# Altium project ESP32_Watch.PrjPcb
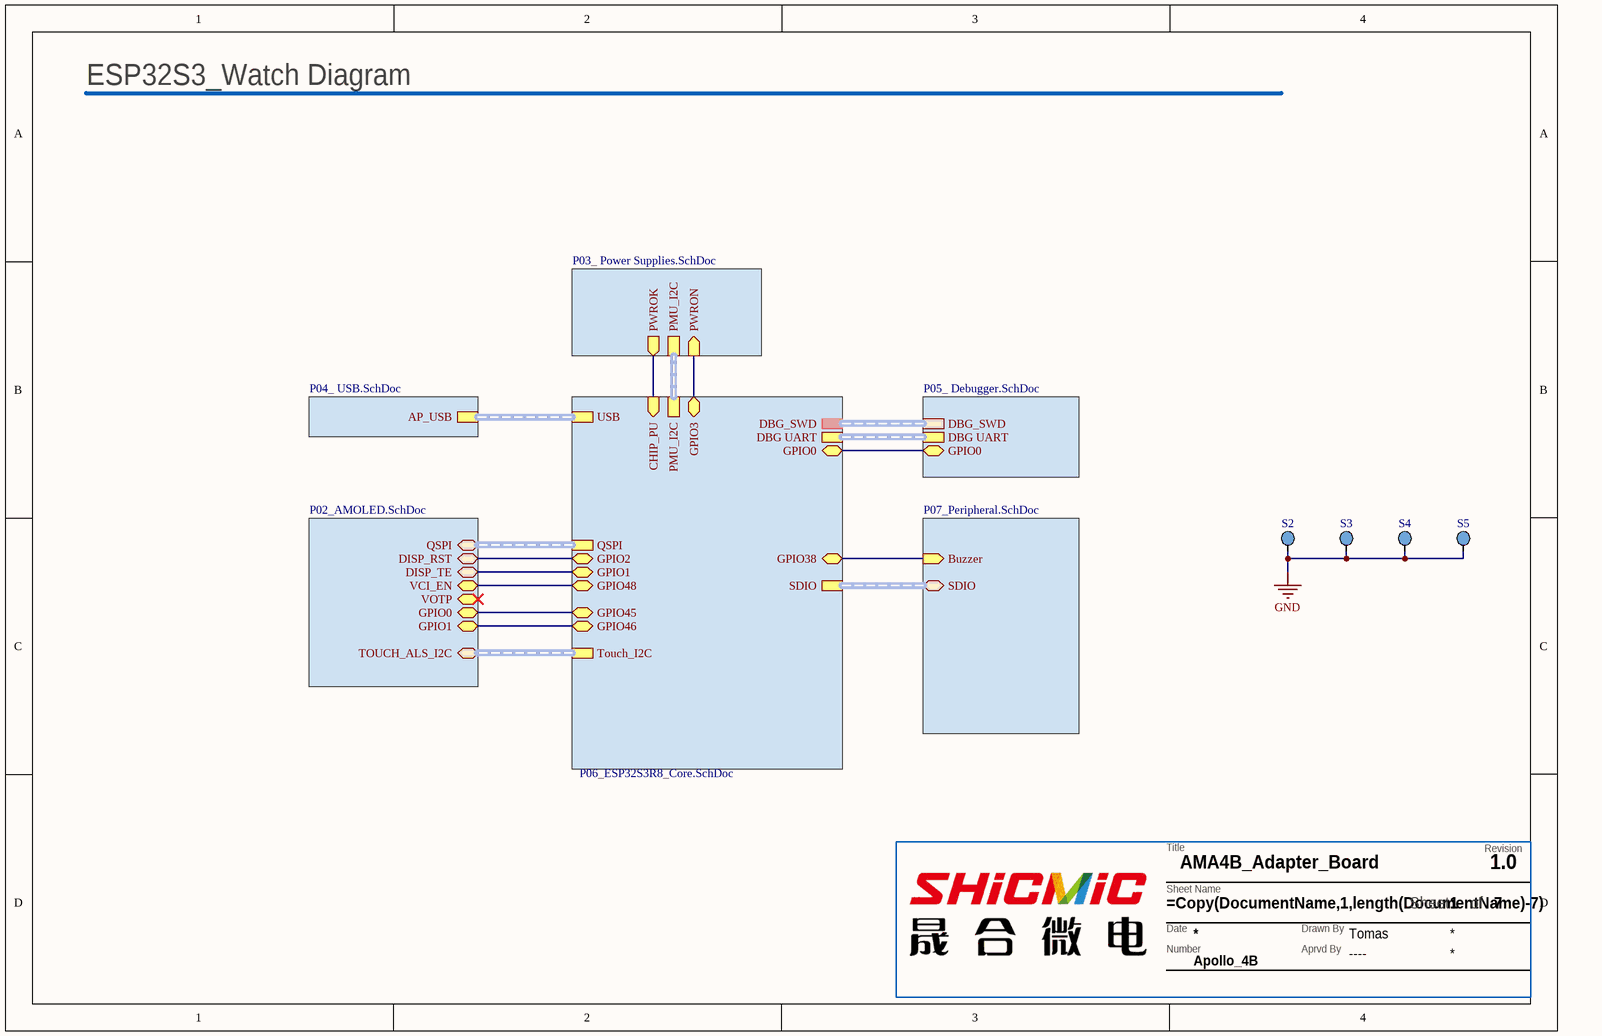
[diagram p0: P01_Top Level.SchDoc]
SheetTotal: 7; TBApprovedBy: ----; TBBoardNumber: Apollo_4B; TBDocumentNumber: Apollo_4B; TBDrawnBy: Tomas; TBRevision: 1.0; TBTitle: AMA4B_Adapter_Board
7 sheets, 75 parts. Net scope: hierarchical (ports join the sheet entries above them; power ports are global).
Board file: ESP_Watch_PCB.PcbDoc
Sheets:
  P01_Top Level.SchDoc
    U_P06_ Apollo4B_core = P06_ESP32S3R8_Core.SchDoc
    U_P03_ Power Supplies = P03_ Power Supplies.SchDoc
    U_P04_ USB = P04_ USB.SchDoc
    U_P05_ Debugger = P05_ Debugger.SchDoc
    U_P02_ AMOLED = P02_AMOLED.SchDoc
    P07_Peripheral = P07_Peripheral.SchDoc

## Sheet P01_Top Level.SchDoc
size A4; SheetNumber: 1; SheetTotal: 7

### Parts
(Parts that share a designator on the sheet are numbered #1, #2 ... from top to bottom, then left to right.)
?#1  TitleBlock  (value not drawn)  (graphical)
S2  Screw_2.9  [HOLE-3.2MM_M]  (value not drawn)
S3  Screw_2.9  [HOLE-3.2MM_M]  (value not drawn)
S4  Screw_2.9  [HOLE-3.2MM_M]  (value not drawn)
S5  Screw_2.9  [HOLE-3.2MM_M]  (value not drawn)

### Sub-sheets
P07_Peripheral = P07_Peripheral.SchDoc: SDIO (bidir, harness SDIO), Buzzer (in)
U_P02_ AMOLED = P02_AMOLED.SchDoc: QSPI (bidir, harness QSPI), DISP_TE (bidir), TOUCH_ALS_I2C (bidir, harness TOUCH_ALS_I2C), DISP_RST (bidir), VOTP (bidir), VCI_EN (bidir), GPIO0 (bidir), GPIO1 (bidir)
U_P03_ Power Supplies = P03_ Power Supplies.SchDoc: PWROK (out), PMU_I2C (harness PMU_I2C), PWRON (in)
U_P04_ USB = P04_ USB.SchDoc: AP_USB (harness USB)
U_P05_ Debugger = P05_ Debugger.SchDoc: DBG_SWD (harness SWD), DBG UART (harness UART), GPIO0 (bidir)
U_P06_ Apollo4B_core = P06_ESP32S3R8_Core.SchDoc: QSPI (harness QSPI), SDIO (harness SDIO), USB (harness USB), DBG_SWD (harness SWD), Touch_I2C (harness TOUCH_ALS_I2C), DBG UART (harness UART), PMU_I2C (harness PMU_I2C), GPIO0 (bidir), GPIO38 (bidir), GPIO1 (bidir), CHIP_PU (in), GPIO48 (bidir), GPIO2 (bidir), GPIO3 (bidir), GPIO45 (bidir), GPIO46 (bidir)

### Nets
GND: S2.1 S3.1 S4.1 S5.1
CHIP_PU: sheet U_P06_ Apollo4B_core/CHIP_PU, sheet U_P03_ Power Supplies/PWROK
GPIO0: sheet U_P06_ Apollo4B_core/GPIO0, sheet U_P05_ Debugger/GPIO0
GPIO1: sheet U_P06_ Apollo4B_core/GPIO1, sheet U_P02_ AMOLED/DISP_TE
GPIO2: sheet U_P06_ Apollo4B_core/GPIO2, sheet U_P02_ AMOLED/DISP_RST
GPIO3: sheet U_P06_ Apollo4B_core/GPIO3, sheet U_P03_ Power Supplies/PWRON
GPIO38: sheet U_P06_ Apollo4B_core/GPIO38, sheet P07_Peripheral/Buzzer
GPIO45: sheet U_P06_ Apollo4B_core/GPIO45, sheet U_P02_ AMOLED/GPIO0
GPIO46: sheet U_P06_ Apollo4B_core/GPIO46, sheet U_P02_ AMOLED/GPIO1
GPIO48: sheet U_P06_ Apollo4B_core/GPIO48, sheet U_P02_ AMOLED/VCI_EN

### Buses and harness runs
harness sheet P07_Peripheral/SDIO = sheet U_P06_ Apollo4B_core/SDIO
harness sheet U_P02_ AMOLED/QSPI = sheet U_P06_ Apollo4B_core/QSPI
harness sheet U_P02_ AMOLED/TOUCH_ALS_I2C = sheet U_P06_ Apollo4B_core/Touch_I2C
harness sheet U_P03_ Power Supplies/PMU_I2C = sheet U_P06_ Apollo4B_core/PMU_I2C
harness sheet U_P04_ USB/AP_USB = sheet U_P06_ Apollo4B_core/USB
harness sheet U_P05_ Debugger/DBG UART = sheet U_P06_ Apollo4B_core/DBG UART
harness sheet U_P05_ Debugger/DBG_SWD = sheet U_P06_ Apollo4B_core/DBG_SWD

### Notes on the sheet
- ESP32S3_Watch Diagram
- (in symbol TitleBlock) Revision; Title; Sheet Name; Sheet; of; Date; Drawn By; Number; Aprvd By

### Library data of the parts
?#1 = TitleBlock: Title block for Ambiq Schematics. Please have the following parameters entered in Project>Project Options>Parameters: / TBTitle / TBDocumentNumber / TBRevision / TBDrawnBy / TBApprovedBy; AMBIQ PN: TitleBlock

## Sheet P06_ESP32S3R8_Core.SchDoc
size A4; SheetNumber: 6; SheetTotal: 7
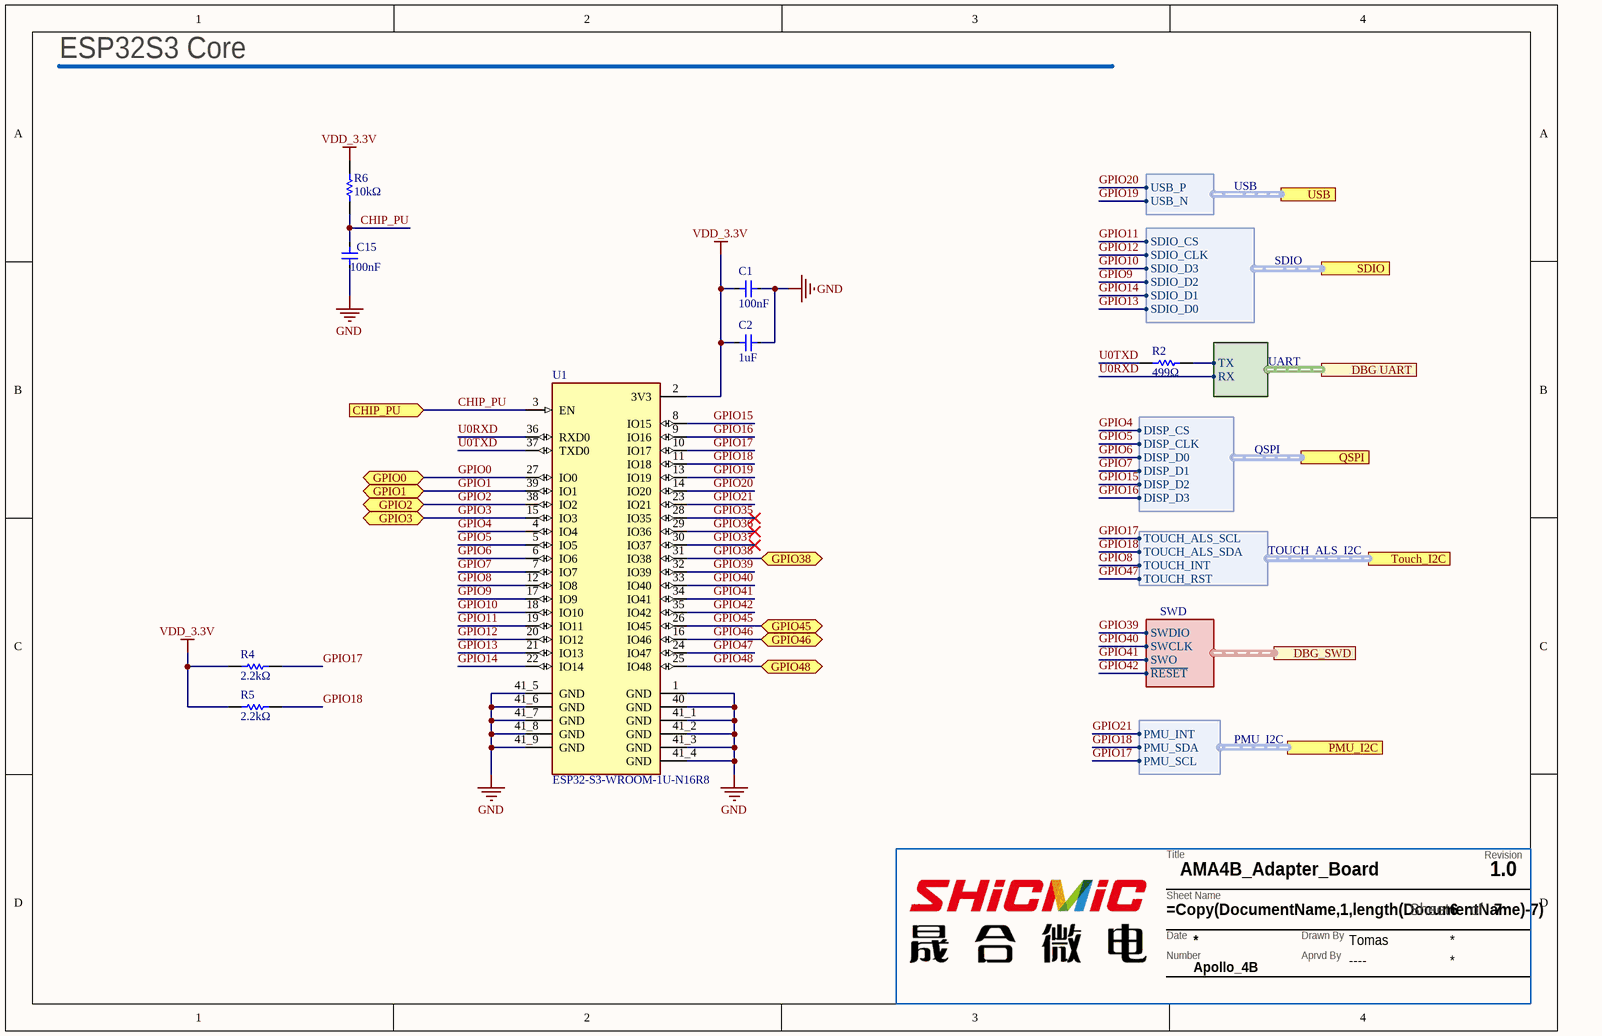
[diagram p1: P06_ESP32S3R8_Core.SchDoc]

### Parts
(Parts that share a designator on the sheet are numbered #1, #2 ... from top to bottom, then left to right.)
?#2  TitleBlock  (value not drawn)  (graphical)
C1  100nF  [CAP_0402]
C2  1uF  [CAP_0402]
C15  100nF  [CAP_0402]
R2  499Ω  [RES_0402]
R4  2.2kΩ  [RES_0402]
R5  2.2kΩ  [RES_0402]
R6  10kΩ  [RES_0402]
U1  ESP32-S3-WROOM-1U-N16R8  [XCVR_ESP32-S3-WROOM-1U-N16R8]

### Ports
CHIP_PU (in), DBG UART (harness UART), DBG_SWD (harness SWD), GPIO0 (bidir), GPIO1 (bidir), GPIO2 (bidir), GPIO3 (bidir), GPIO38 (bidir), GPIO45 (bidir), GPIO46 (bidir), GPIO48 (bidir), PMU_I2C (harness PMU_I2C), QSPI (harness QSPI), SDIO (harness SDIO), Touch_I2C (harness TOUCH_ALS_I2C), USB (harness USB)

### Harnesses
QSPI: DISP_CLK, DISP_CS, DISP_D0, DISP_D1, DISP_D2, DISP_D3
TOUCH_ALS_I2C: TOUCH_ALS_SCL, TOUCH_ALS_SDA, TOUCH_INT, TOUCH_RST
SDIO: SDIO_CLK, SDIO_CS, SDIO_D0, SDIO_D1, SDIO_D2, SDIO_D3
USB: USB_N, USB_P
SWD: SWCLK, SWDIO, SWO, ~{RESET}
UART: TX, RX
PMU_I2C: PMU_SCL, PMU_SDA, PMU_INT

### Nets
GND: C1.2 C2.2 C15.2 U1.1(GND) U1.40(GND) U1.41_1(GND) U1.41_2(GND) U1.41_3(GND) U1.41_4(GND) U1.41_5(GND) U1.41_6(GND) U1.41_7(GND) U1.41_8(GND) U1.41_9(GND)
VDD_3.3V: C1.1 C2.1 R4.1 R5.1 R6.2 U1.2(3V3)
CHIP_PU: C15.1 R6.1 U1.3(EN) ; port CHIP_PU
GPIO0: U1.27(IO0) ; port GPIO0
GPIO1: U1.39(IO1) ; port GPIO1
GPIO2: U1.38(IO2) ; port GPIO2
GPIO3: U1.15(IO3) ; port GPIO3
GPIO4: U1.4(IO4) ; port QSPI.DISP_CS
GPIO5: U1.5(IO5) ; port QSPI.DISP_CLK
GPIO6: U1.6(IO6) ; port QSPI.DISP_D0
GPIO7: U1.7(IO7) ; port QSPI.DISP_D1
GPIO8: U1.12(IO8) ; port Touch_I2C.TOUCH_INT
GPIO9: U1.17(IO9) ; port SDIO.SDIO_D2
GPIO10: U1.18(IO10) ; port SDIO.SDIO_D3
GPIO11: U1.19(IO11) ; port SDIO.SDIO_CS
GPIO12: U1.20(IO12) ; port SDIO.SDIO_CLK
GPIO13: U1.21(IO13) ; port SDIO.SDIO_D0
GPIO14: U1.22(IO14) ; port SDIO.SDIO_D1
GPIO15: U1.8(IO15) ; port QSPI.DISP_D2
GPIO16: U1.9(IO16) ; port QSPI.DISP_D3
GPIO17: R4.2 U1.10(IO17) ; port Touch_I2C.TOUCH_ALS_SCL, port PMU_I2C.PMU_SCL
GPIO18: R5.2 U1.11(IO18) ; port Touch_I2C.TOUCH_ALS_SDA, port PMU_I2C.PMU_SDA
GPIO19: U1.13(IO19) ; port USB.USB_N  [project net AP_USB_N]
GPIO20: U1.14(IO20) ; port USB.USB_P  [project net AP_USB_P]
GPIO21: U1.23(IO21) ; port PMU_I2C.PMU_INT
GPIO35: U1.28(IO35)
GPIO36: U1.29(IO36)
GPIO37: U1.30(IO37)
GPIO38: U1.31(IO38) ; port GPIO38
GPIO39: U1.32(IO39) ; port DBG_SWD.SWDIO
GPIO40: U1.33(IO40) ; port DBG_SWD.SWCLK
GPIO41: U1.34(IO41) ; port DBG_SWD.SWO
GPIO42: U1.35(IO42) ; port DBG_SWD.~{RESET}
GPIO45: U1.26(IO45) ; port GPIO45
GPIO46: U1.16(IO46) ; port GPIO46
GPIO47: U1.24(IO47) ; port Touch_I2C.TOUCH_RST
GPIO48: U1.25(IO48) ; port GPIO48
U0RXD: U1.36(RXD0) ; port DBG UART.RX
U0TXD: R2.1 U1.37(TXD0)
NetR2_2: R2.2 ; port DBG UART.TX

### Notes on the sheet
- ESP32S3 Core
- (in symbol TitleBlock) Revision; Title; Sheet Name; Sheet; of; Date; Drawn By; Number; Aprvd By

### Library data of the parts
?#2 = TitleBlock: as ?#1 on sheet P01_Top Level; AMBIQ PN: TitleBlock
C1 C15 = Capacitor: NONE; Manufacturer: Samsung; Manufacturer Part Number: CL05A105MP5NNNC; AMBIQ PN: CL05A105KP5NNNC; Capacitance: 1uF; Tolerance: 20%; Voltage Rating: 10V; Dielectric: X5R; Supplier 1: Newark; Supplier Part Number 1: 82AC9184; RoHS: Yes; Category: Ceramic Capacitors; Mount: Surface Mount; Case/Package: 0402; Case Code (Metric): 1005; Case Code (Imperial): 0402; Min Operating Temperature: -55°C; Max Operating Temperature: 85°C; Packaging: Tape and Reel; Voltage Rating (DC): 10V; Series: CL; Construction: Flat; Length: 1mm; Width: 0.02inch; Height: 0.5mm; Thickness: 0.022inch; Depth: 0.5mm; Radiation Hardening: No; Lead Free: Lead Free; RoHS Compliant: Yes; ComponentLink1URL: https://datasheet.ciiva.com/25802/cl05a105mp5nnnc-25802049.pdf?src-supplier=Digi-Key; ComponentLink1Description: https://datasheet.ciiva.com/25802/cl05a105mp5nnnc-25802049.pdf?src-supplier=Digi-Key; Package Quantity: 1
C2 = Capacitor: NONE; Manufacturer: Samsung; Manufacturer Part Number: CL05A105MP5NNNC; AMBIQ PN: CL05A105KP5NNNC; Tolerance: 20%; Voltage Rating: 10V; Dielectric: X5R; Supplier 1: Newark; Supplier Part Number 1: 82AC9184; RoHS: Yes; Category: Ceramic Capacitors; Mount: Surface Mount; Case/Package: 0402; Case Code (Metric): 1005; Case Code (Imperial): 0402; Min Operating Temperature: -55°C; Max Operating Temperature: 85°C; Capacitance: 1uF; Packaging: Tape and Reel; Voltage Rating (DC): 10V; Series: CL; Construction: Flat; Length: 1mm; Width: 0.02inch; Height: 0.5mm; Thickness: 0.022inch; Depth: 0.5mm; Radiation Hardening: No; Lead Free: Lead Free; RoHS Compliant: Yes; ComponentLink1URL: https://datasheet.ciiva.com/25802/cl05a105mp5nnnc-25802049.pdf?src-supplier=Digi-Key; ComponentLink1Description: https://datasheet.ciiva.com/25802/cl05a105mp5nnnc-25802049.pdf?src-supplier=Digi-Key; Package Quantity: 1
R2 R4-R6 = Resistor: Res Thick Film 0402 20K Ohm 1% 1/16W ±100ppm/°C Molded SMD Paper T/R; Manufacturer: Vishay; AMBIQ PN: CRCW040220K0FKED; Resistance: 20kR; Power Rating: 63mW; Voltage Rating: 50V; Supplier 1: Newark; Supplier Part Number 1: 24W2083; Manufacturer Part Number: CRCW040220K0FKED; RoHS: Yes; Category: Chip SMD Resistors; Stock 1: 380000; Pricing 1: 1=0.00600, 10000=0.00600 (USD); Mount: Surface Mount; Case/Package: 0402; Weight: 2.3E-05oz; Case Code (Metric): 1005; Case Code (Imperial): 0402; Contact Plating: Tin; Min Operating Temperature: -55°C; Max Operating Temperature: 155°C; Package Quantity: 10; Packaging: Tape and Reel; Resistor Type: Thick Film; Number of Terminations: 2; Termination: SMD/SMT; Max Power Dissipation: 63mW; Temperature Coefficient: 100ppm/°C; Voltage Rating (DC): 50V; Features: Automotive AEC-Q200; Series: CRCW; Technology: THICK FILM; Construction: Rectangular; Length: 1mm; Width: 0.5mm; Height: 0.35mm; Depth: 0.5mm; Radiation Hardening: No; REACH SVHC: Unknown; Military Standard: Not; Lead Free: Lead Free; RoHS Compliant: Yes; ComponentLink1URL: https://datasheet.ciiva.com/11810/0900766b80d98824-11810023.pdf?src-supplier=RSComponents; ComponentLink1Description: https://datasheet.ciiva.com/11810/0900766b80d98824-11810023.pdf?src-supplier=RSComponents; ComponentLink2URL: https://datasheet.ciiva.com/2463/dcrcwe3-2463139.pdf?src-supplier=Digi-Key; ComponentLink2Description: https://datasheet.ciiva.com/2463/dcrcwe3-2463139.pdf?src-supplier=Digi-Key; ComponentLink3URL: https://datasheet.ciiva.com/2463/dcrcwe3-2463140.pdf?src-supplier=Digi-Key; Tolerance: 1%; Number of Pins: 2; Resistance Tolerance: 1%; Working Voltage: 50V
U1 = ESP32-S3-WROOM-1U-N16R8: Bluetooth, WiFi 802.11b/g/n, Bluetooth v5.0 Transceiver Module 2.4GHz Antenna Not Included, U.FL Surface Mount; MF: Espressif Systems; Package: None; Price: None; Value: *; SnapEDA_Link: https://www.snapeda.com/parts/ESP32-S3-WROOM-1U-N16R8/Espressif+Systems/view-part/?ref=snap; MP: ESP32-S3-WROOM-1U-N16R8; Availability: Unavailable; Check_prices: https://www.snapeda.com/parts/ESP32-S3-WROOM-1U-N16R8/Espressif+Systems/view-part/?ref=eda

## Sheet P03_ Power Supplies.SchDoc
size A3; SheetNumber: 3; SheetTotal: 7
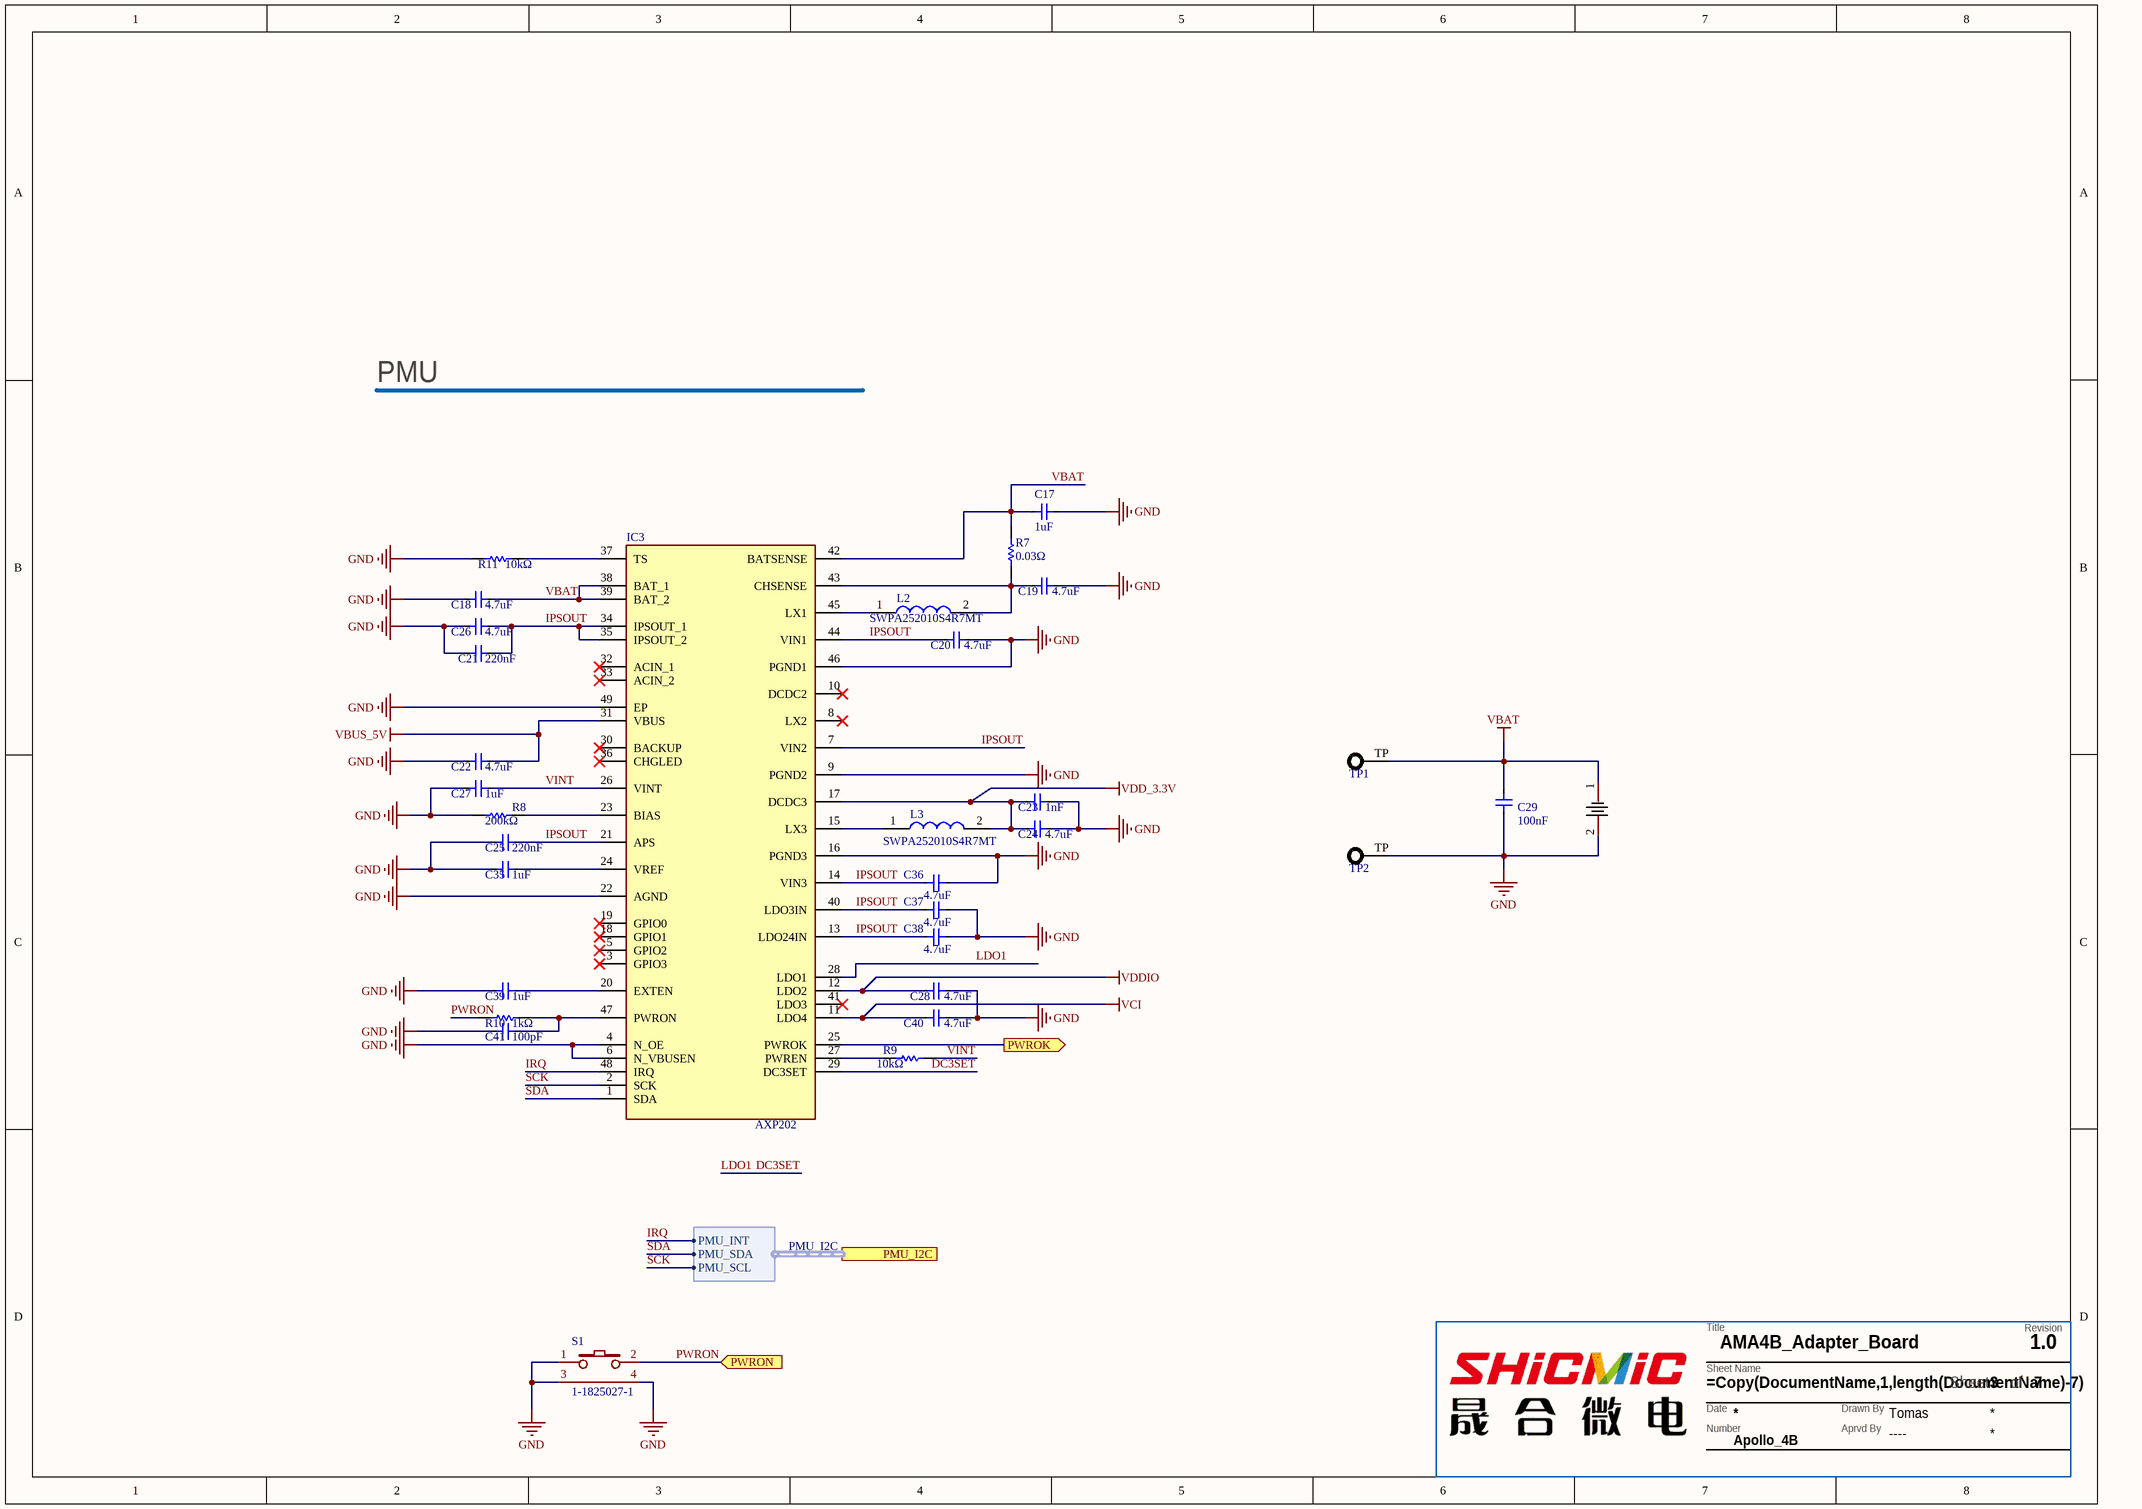
[diagram p2: P03_ Power Supplies.SchDoc]

### Parts
(Parts that share a designator on the sheet are numbered #1, #2 ... from top to bottom, then left to right.)
?#3  TitleBlock  (value not drawn)  (graphical)
BT1  BH-18650-B1BA002  [BATTERY-SMD_18650-1S-L77.1-W20.7-1]  (value not drawn)
C17  1uF  [CAP_0402]
C18  4.7uF  [CAP_0402]
C19  4.7uF  [CAP_0402]
C20  4.7uF  [CAP_0402]
C21  220nF  [CAP_0402]
C22  4.7uF  [CAP_0402]
C23  1nF  [CAP_0402]
C24  4.7uF  [CAP_0402]
C25  220nF  [CAP_0402]
C26  4.7uF  [CAP_0402]
C27  1uF  [CAP_0402]
C28  4.7uF  [CAP_0402]
C29  100nF  [CAP_0402]
C35  1uF  [CAP_0402]
C36  4.7uF  [CAP_0402]
C37  4.7uF  [CAP_0402]
C38  4.7uF  [CAP_0402]
C39  1uF  [CAP_0402]
C40  4.7uF  [CAP_0402]
C41  100pF  [CAP_0402]
IC3  AXP202  [QFN40P600X600X80-49N-D]
L2  SWPA252010S4R7MT  [SWPA252010S4R7MT]
L3  SWPA252010S4R7MT  [SWPA252010S4R7MT]
R7  0.03Ω  [RESC2013X58N]
R8  200kΩ  [RES_0402]
R9  10kΩ  [RES_0402]
R10  1kΩ  [RES_0402]
R11  10kΩ  [RES_0402]
S1  1-1825027-1  [1825027-5]
TP1  PAD  [TPPAD_1.0mm]  (value not drawn)  (no BOM)
TP2  PAD  [TPPAD_1.0mm]  (value not drawn)  (no BOM)

### Ports
PMU_I2C (harness PMU_I2C), PWROK (out), PWRON (in)

### Harnesses
PMU_I2C: PMU_SCL, PMU_SDA, PMU_INT

### Nets
GND: BT1.2 C17.1 C18.1 C19.1 C20.1 C21.1 C22.1 C23.1 C24.1 C25.1 C26.1 C27.1 C28.1 C29.2 C35.1 C36.1 C37.1 C38.1 C39.1 C40.1 C41.1 IC3.4(N_OE) IC3.6(N_VBUSEN) IC3.9(PGND2) IC3.16(PGND3) IC3.22(AGND) IC3.46(PGND1) IC3.49(EP) R8.1 R11.1 S1.1 S1.3(MH1) S1.4(MH2) TP2.TP
VBAT: BT1.1 C17.2 C18.2 C29.1 IC3.38(BAT_1) IC3.39(BAT_2) IC3.42(BATSENSE) R7.2 TP1.TP
VBUS_5V: C22.2 IC3.31(VBUS)
VCI: C40.2 IC3.11(LDO4)
VDD_3.3V: C23.2 C24.2 IC3.17(DCDC3) L3.2
VDDIO: C28.2 IC3.12(LDO2)
CHIP_PU: IC3.25(PWROK) ; port PWROK
DC3SET: IC3.28(LDO1) IC3.29(DC3SET)  [also labelled LDO1]
IPSOUT: C20.2 C21.2 C25.2 C26.2 C36.2 C37.2 C38.2 IC3.7(VIN2) IC3.13(LDO24IN) IC3.14(VIN3) IC3.21(APS) IC3.34(IPSOUT_1) IC3.35(IPSOUT_2) IC3.40(LDO3IN) IC3.44(VIN1)
IRQ: IC3.48(IRQ) ; port PMU_I2C.PMU_INT  [project net GPIO21]
PWRON: R10.1 S1.2 ; port PWRON  [project net GPIO3]
SCK: IC3.2(SCK) ; port PMU_I2C.PMU_SCL  [project net GPIO17]
SDA: IC3.1(SDA) ; port PMU_I2C.PMU_SDA  [project net GPIO18]
VINT: C27.2 IC3.26(VINT) R9.1
NetC19_2: C19.2 IC3.43(CHSENSE) L2.2 R7.1
NetC35_2: C35.2 IC3.24(VREF)
NetC39_2: C39.2 IC3.20(EXTEN)
NetC41_2: C41.2 IC3.47(PWRON) R10.2
NetIC3_15: IC3.15(LX3) L3.1
NetIC3_23: IC3.23(BIAS) R8.2
NetIC3_27: IC3.27(PWREN) R9.2
NetIC3_37: IC3.37(TS) R11.2
NetIC3_45: IC3.45(LX1) L2.1

Not connected (* = marked no-connect by the designer): IC3 3(GPIO3)* 5(GPIO2)* 8(LX2)* 10(DCDC2)* 18(GPIO1)* 19(GPIO0)* 30(BACKUP)* 32(ACIN_1)* 33(ACIN_2)* 36(CHGLED)* 41(LDO3)*

### Notes on the sheet
- PMU
- (in symbol TitleBlock) Revision; Title; Sheet Name; Sheet; of; Date; Drawn By; Number; Aprvd By

### Library data of the parts
?#3 = TitleBlock: as ?#1 on sheet P01_Top Level; AMBIQ PN: TitleBlock
BT1 = BH-18650-B1BA002: Manufacturer: MYOUNG(美阳); Add into BOM: yes; Connector Type: 电池盒; Battery Type: 18650; Name: BH-18650-B1BA002; Symbol: BH-18650-B1BA002; Device: BH-18650-B1BA002; LCSC Part Name: 电池盒 适用电池:18650; Supplier Part: C2988620; Manufacturer Part: BH-18650-B1BA002; Supplier Footprint: SMD; JLCPCB Part Class: Extended Part; Datasheet: https://atta.szlcsc.com/upload/public/pdf/source/20220402/870DB99AB50CA0DF8D51CF7C86A51FAB.pdf; Supplier: LCSC; Convert to PCB: yes
C17-C28 C35-C41 = Capacitor: NONE; Manufacturer: Samsung; AMBIQ PN: CL05A225KP5NNNC; Capacitance: 2.2uF; Tolerance: 10%; Voltage Rating: 10V; Supplier 1: Arrow Electronics; Supplier Part Number 1: CL05A225KP5NNNC; Manufacturer Part Number: CL05A225KP5NNNC; RoHS: Yes; Category: Ceramic Capacitors; Stock 1: 32414; Pricing 1: 1=0.14620, 10=0.09980, 25=0.09880, 100=0.05200, 250=0.05150, 500=0.03630, 1000=0.02990, 3000=0.02760, 6000=0.02610, 15000=0.023; Mount: Surface Mount; Case/Package: 0402; Case Code (Metric): 1005; Case Code (Imperial): 0402; Min Operating Temperature: -55°C; Max Operating Temperature: 85°C; Packaging: Tape and Reel; Voltage Rating (DC): 10V; Series: CL; Length: 0.039inch; Width: 0.02inch; Thickness: 0.022inch; RoHS Compliant: Yes; ComponentLink1URL: https://datasheet.ciiva.com/25727/cl05a225kp5nnnc-25727777.pdf?src-supplier=Digi-Key; ComponentLink1Description: https://datasheet.ciiva.com/25727/cl05a225kp5nnnc-25727777.pdf?src-supplier=Digi-Key; Package Quantity: 1
C29 = Capacitor: NONE; Manufacturer: Kyocera AVX; AMBIQ PN: 0201ZD104KAT2A; Tolerance: 10%; Voltage Rating: 10V; Supplier 1: Arrow Electronics; Supplier Part Number 1: 0201ZD104KAT2A; Manufacturer Part Number: 0201ZD104KAT2A; RoHS: Yes; Category: Ceramic Capacitors; Stock 1: 105000; Pricing 1: 15000=0.00770, 30000=0.00750, 45000=0.00740, 60000=0.00720, 75000=0.00690, 150000=0.00620 (USD); Mount: Surface Mount; Case/Package: 0201; Case Code (Metric): 0603; Case Code (Imperial): 0201; Min Operating Temperature: -55°C; Max Operating Temperature: 85°C; Capacitance: 100nF; Packaging: Tape and Reel; Voltage Rating (DC): 10V; Series: -; Lead Free: Lead Free; RoHS Compliant: Yes; ComponentLink1URL: http://www.mouser.com/ds/2/40/cx5r-776519.pdf?src-supplier=Mouser; ComponentLink1Description: http://www.mouser.com/ds/2/40/cx5r-776519.pdf?src-supplier=Mouser
IC3 = AXP202: Integrated Circuit; Manufacturer_Name: X-Powers; Datasheet Link: http://www.x-powers.com/en.php/Info/down/id/55; Height: 0.8mm; Manufacturer_Part_Number: AXP202
L2 L3 = SWPA252010S4R7MT: Inductor; Manufacturer_Name: SUNLORD; Datasheet Link: https://www.sunlordinc.com/Download.aspx?file=L1VwbG9hZEZpbGVzL1BERl9DYXQvMjAyMjA2MDcxMDAxMzg2MzEucGRm&lan=en; Height: 1mm; Manufacturer_Part_Number: SWPA252010S4R7MT
R7 = WSL0805R0300FEA18: Resistor; Manufacturer_Name: Vishay; Datasheet Link: https://www.vishay.com/docs/31057/wslhigh.pdf; Height: 0.584mm; Manufacturer_Part_Number: WSL0805R0300FEA18; Mouser Part Number: 71-WSL0805R0300FEA18; Mouser Price/Stock: https://www.mouser.co.uk/ProductDetail/Vishay-Dale/WSL0805R0300FEA18?qs=Dk6UgDv3OKgnZ05Ewij84g%3D%3D
R8-R11 = Resistor: Surface Mount Thick Film Resistor, Rc Series, 10 Kohm, 62.5 Mw, - 1%, 50 V, 0402 [1005 Metric]; Manufacturer: Yageo; AMBIQ PN: RC0402FR-0710KL; Resistance: 10kR; Power Rating: 62.5mW; Voltage Rating: 50V; Max Power Dissipation: 63mW; Temperature Coefficient: 100ppm/°C; Supplier 1: Arrow Electronics; Supplier Part Number 1: RC0402FR-0710KL; Manufacturer Part Number: RC0402FR-0710KL; RoHS: Yes; Category: Chip SMD Resistors; Stock 1: 7776428; Pricing 1: 10000=0.00210 (USD); Case/Package: 0402; Case Code (Metric): 1005; Case Code (Imperial): 0402; Min Operating Temperature: -55°C; Max Operating Temperature: 155°C; Packaging: Tape and Reel; Resistor Type: Thick Film; Number of Terminations: 2; Termination: SMD/SMT; Voltage Rating (DC): 50V; Features: Moisture Resistant; Series: RC; Construction: Rectangular; Length: 1mm; Width: 0.5mm; Height: 0.32mm; Depth: 0.5mm; REACH SVHC: No SVHC; Military Standard: Not; Lead Free: Lead Free; RoHS Compliant: Yes; ComponentLink1URL: https://datasheet.ciiva.com/7660/38568-7660787.pdf?src-supplier=Element14; ComponentLink1Description: https://datasheet.ciiva.com/7660/38568-7660787.pdf?src-supplier=Element14; ComponentLink2URL: https://datasheet.ciiva.com/7849/1686128-7849814.pdf?src-supplier=Element14; ComponentLink2Description: https://datasheet.ciiva.com/7849/1686128-7849814.pdf?src-supplier=Element14; ComponentLink3URL: https://datasheet.ciiva.com/7983/1018594-7983486.pdf?src-supplier=Element14; Tolerance: 1%; Number of Pins: 2; Resistance Tolerance: 1%; Working Voltage: 50V; Lead Pitch: 0.2mm
S1 = 1-1825027-1: Switch; Manufacturer_Name: TE Connectivity; Manufacturer_Part_Number: FSMRA4JH04; Datasheet Link: https://www.te.com/commerce/DocumentDelivery/DDEController?Action=srchrtrv&DocNm=1308111-1_SWITCHES_CORE_PROGRAM_CATALOG&DocType=CS&DocLang=English; Height: 7.01mm; Mouser Part Number: 506-FSMRA4JH04; Mouser Price/Stock: https://www.mouser.co.uk/ProductDetail/TE-Connectivity-Alcoswitch/FSMRA4JH04?qs=65SUpkGmTbapQKkEnx7SmQ%3D%3D; Arrow Part Number: 1-1825027-1; Arrow Price/Stock: https://www.arrow.com/en/products/1-1825027-1/te-connectivity
TP1 TP2 = TP_PAD: None; AMBIQ PN: TP_PAD

## Sheet P04_ USB.SchDoc
size A4; SheetNumber: 4; SheetTotal: 7
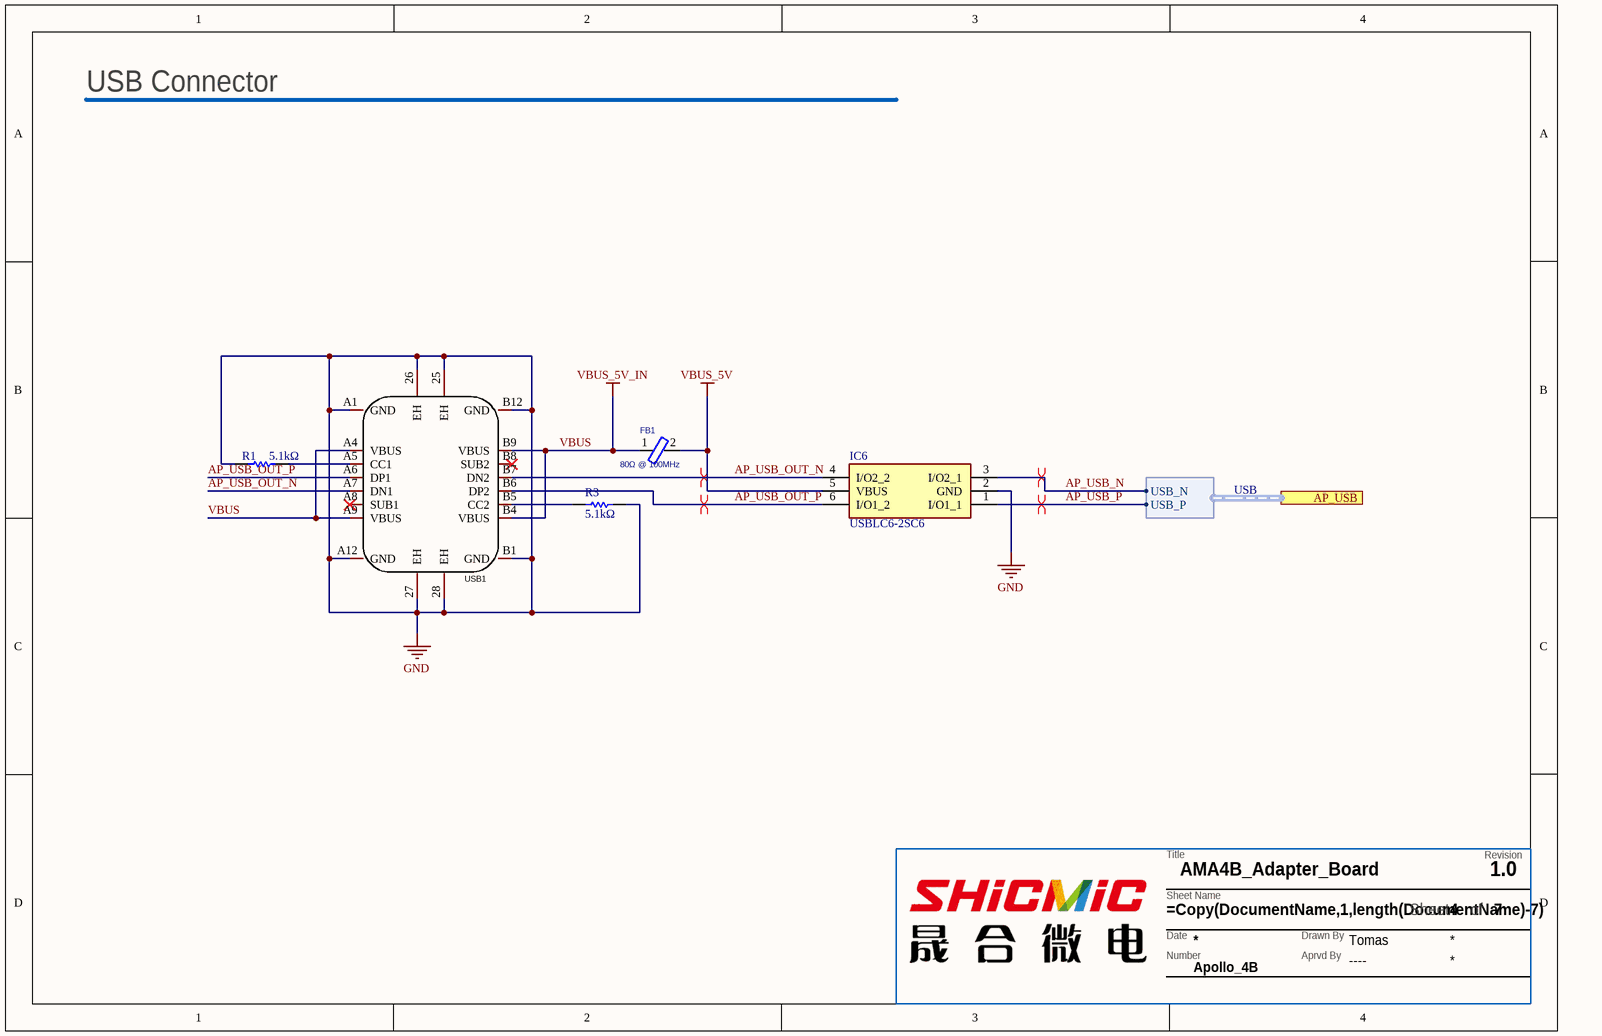
[diagram p3: P04_ USB.SchDoc]

### Parts
(Parts that share a designator on the sheet are numbered #1, #2 ... from top to bottom, then left to right.)
?#4  TitleBlock  (value not drawn)  (graphical)
FB1  80Ω @ 100MHz  [IPC_A]
IC6  USBLC6-2SC6  [SOT95P280X145-6N]
R1  5.1kΩ  [RES_0402]
R3  5.1kΩ  [RES_0402]
USB1  TYPE-C 16P CB1.6 073  [USB-C-SMD_SHOU_TYPE-C-16P-CB1.6]  (value not drawn)

### Ports
AP_USB (harness USB)

### Harnesses
USB: USB_N, USB_P

### Nets
GND: IC6.2(GND) R1.1 R3.2 USB1.25(EH) USB1.26(EH) USB1.27(EH) USB1.28(EH) USB1.A1(GND) USB1.A12(GND) USB1.B1(GND) USB1.B12(GND)
VBUS: FB1.1 USB1.A4(VBUS) USB1.A9(VBUS) USB1.B4(VBUS) USB1.B9(VBUS)  [also labelled VBUS_5V_IN]
VBUS_5V: FB1.2 IC6.5(VBUS)
AP_USB_N: IC6.3(I/O2_1) ; port AP_USB.USB_N
AP_USB_OUT_N: IC6.4(I/O2_2) USB1.A7(DN1) USB1.B7(DN2)
AP_USB_OUT_P: IC6.6(I/O1_2) USB1.A6(DP1) USB1.B6(DP2)
AP_USB_P: IC6.1(I/O1_1) ; port AP_USB.USB_P
NetR1_2: R1.2 USB1.A5(CC1)
NetR3_1: R3.1 USB1.B5(CC2)

Not connected (* = marked no-connect by the designer): USB1 A8(SUB1)* B8(SUB2)*

### Layout directives
differential pair: AP_USB_N, AP_USB_OUT_N, AP_USB_OUT_P, AP_USB_P

### Notes on the sheet
- USB Connector
- (in symbol TitleBlock) Revision; Title; Sheet Name; Sheet; of; Date; Drawn By; Number; Aprvd By

### Library data of the parts
?#4 = TitleBlock: as ?#1 on sheet P01_Top Level; AMBIQ PN: TitleBlock
FB1 = Ferrite: NONE; Manufacturer: Taiyo Yuden; AMBIQ PN: FBMJ3216HS800-T; Impedance: 80R; Tolerance: 25%; DC Resistance (DCR): 10mR; Max DC Current: 4A; Number of Lines: 1; Shielding: Unshielded; Supplier 1: Newark; Supplier Part Number 1: 86H5353; Manufacturer Part Number: FBMJ3216HS800-T; RoHS: Yes; Category: Ferrite Beads and Chips; Stock 1: 265; Pricing 1: 1=0.30000, 10=0.20700, 25=0.17700, 50=0.14800, 100=0.11800 (USD); ComponentLink1URL: https://datasheet.ciiva.com/5709/chipbeads01-e-5709344.pdf?src-supplier=Farnell; ComponentLink1Description: https://datasheet.ciiva.com/5709/chipbeads01-e-5709344.pdf?src-supplier=Farnell; Mount: Surface Mount; Case/Package: 1206; Number of Pins: 2; Core Material: Ferrite; Case Code (Metric): 3216; Case Code (Imperial): 1206; Material: Ferrite; Min Operating Temperature: -40°C; Max Operating Temperature: 125°C; Packaging: Tape and Reel; Resistance: 10mR; Package Quantity: 1; Max Current Rating: 4A; Termination: SMD/SMT; Test Frequency: 100MHz; Frequency: 100MHz; Series: FB; Resistor Type: Ferrite Bead; Length: 3.2mm; Width: 0.063inch; Height: 1.3mm; Depth: 1.8mm; Lead Free: Lead Free; Halogen Free: Halogen Free; REACH SVHC: No SVHC; ComponentLink2URL: https://datasheet.ciiva.com/16001/202fbmj3216hs800-t-16001070.pdf?src-supplier=Onlinecomponents.com; ComponentLink2Description: https://datasheet.ciiva.com/16001/202fbmj3216hs800-t-16001070.pdf?src-supplier=Onlinecomponents.com; ComponentLink3URL: https://datasheet.ciiva.com/30088/23fbmj3216hs800-t-30088710.pdf?src-supplier=Onlinecomponents.com; ComponentLink3Description: https://datasheet.ciiva.com/30088/23fbmj3216hs800-t-30088710.pdf?src-supplier=Onlinecomponents.com; ComponentLink4URL: https://datasheet.ciiva.com/23606/fbmj3216hs800-t-ss-23606768.pdf?src-supplier=Newark; ComponentLink4Description: https://datasheet.ciiva.com/23606/fbmj3216hs800-t-ss-23606768.pdf?src-supplier=Newark; ComponentLink5URL: https://datasheet.ciiva.com/25614/0900766b810b37be-25614395.pdf?src-supplier=RSComponents; ComponentLink5Description: https://datasheet.ciiva.com/25614/0900766b810b37be-25614395.pdf?src-supplier=RSComponents; ComponentLink6URL: https://datasheet.ciiva.com/6212/chipbeads01-e-6212909.pdf?src-supplier=Digi-Key; ComponentLink6Description: https://datasheet.ciiva.com/6212/chipbeads01-e-6212909.pdf?src-supplier=Digi-Key; ComponentLink7URL: https://datasheet.ciiva.com/7966/chipbeads01-e-7966171.pdf?src-supplier=Element14; ComponentLink7Description: https://datasheet.ciiva.com/7966/chipbeads01-e-7966171.pdf?src-supplier=Element14
IC6 = USBLC6-2SC6: Integrated Circuit; Manufacturer_Name: STMicroelectronics; Datasheet Link: http://www.st.com/st-web-ui/static/active/en/resource/technical/document/datasheet/CD00050750.pdf; Height: 1.45mm; Manufacturer_Part_Number: USBLC6-2SC6; Mouser Part Number: 511-USBLC6-2SC6; Mouser Price/Stock: https://www.mouser.co.uk/ProductDetail/STMicroelectronics/USBLC6-2SC6?qs=po45yt2pPpu%2FhNIlwQdTlg%3D%3D; Arrow Part Number: USBLC6-2SC6; Arrow Price/Stock: https://www.arrow.com/en/products/usblc6-2sc6/stmicroelectronics?region=nac
R1 R3 = Resistor: as R2 on sheet P06_ESP32S3R8_Core; Supplier 1: Newark; Supplier Part Number 1: 24W2083; Manufacturer Part Number: CRCW040220K0FKED; RoHS: Yes; Category: Chip SMD Resistors; Stock 1: 380000; Pricing 1: 1=0.00600, 10000=0.00600 (USD); Mount: Surface Mount; Case/Package: 0402; Weight: 2.3E-05oz; Case Code (Metric): 1005; Case Code (Imperial): 0402; Contact Plating: Tin; Min Operating Temperature: -55°C; Max Operating Temperature: 155°C; Package Quantity: 10; Packaging: Tape and Reel; Resistor Type: Thick Film; Number of Terminations: 2; Termination: SMD/SMT; Max Power Dissipation: 63mW; Temperature Coefficient: 100ppm/°C; Voltage Rating (DC): 50V; Features: Automotive AEC-Q200; Series: CRCW; Technology: THICK FILM; Construction: Rectangular; Length: 1mm; Width: 0.5mm; Height: 0.35mm; Depth: 0.5mm; Radiation Hardening: No; REACH SVHC: Unknown; Military Standard: Not; Lead Free: Lead Free; RoHS Compliant: Yes; ComponentLink1URL: https://datasheet.ciiva.com/11810/0900766b80d98824-11810023.pdf?src-supplier=RSComponents; ComponentLink1Description: https://datasheet.ciiva.com/11810/0900766b80d98824-11810023.pdf?src-supplier=RSComponents; ComponentLink2URL: https://datasheet.ciiva.com/2463/dcrcwe3-2463139.pdf?src-supplier=Digi-Key; ComponentLink2Description: https://datasheet.ciiva.com/2463/dcrcwe3-2463139.pdf?src-supplier=Digi-Key; ComponentLink3URL: https://datasheet.ciiva.com/2463/dcrcwe3-2463140.pdf?src-supplier=Digi-Key; Tolerance: 1%; Number of Pins: 2; Resistance Tolerance: 1%; Working Voltage: 50V
USB1 = TYPE-C 16P CB1.6 073: Manufacturer: SHOU HAN(首韩); Add into BOM: yes; Gender: 母; Number of Ports: 1; Current Rating - Power (Max): 3A; Name: TYPE-C 16P CB1.6 073; Symbol: TYPE-C 16P CB1.6 073; Device: TYPE-C 16P CB1.6 073; LCSC Part Name: Type-C 母 沉板; Supplier Part: C2906290; Manufacturer Part: TYPE-C 16P CB1.6 073; Supplier Footprint: SMD; JLCPCB Part Class: Extended Part; Datasheet: https://atta.szlcsc.com/upload/public/pdf/source/20211021/35D048B933FA988260DD32545575C1A5.pdf; Supplier: LCSC; Convert to PCB: yes; Connector Type: Type-C; Standard: -; Number of Contacts: 16P; Mounting Style: 沉板; Operating Temperature Range: -25℃~+85℃

## Sheet P05_ Debugger.SchDoc
size A4; SheetNumber: 5; SheetTotal: 7
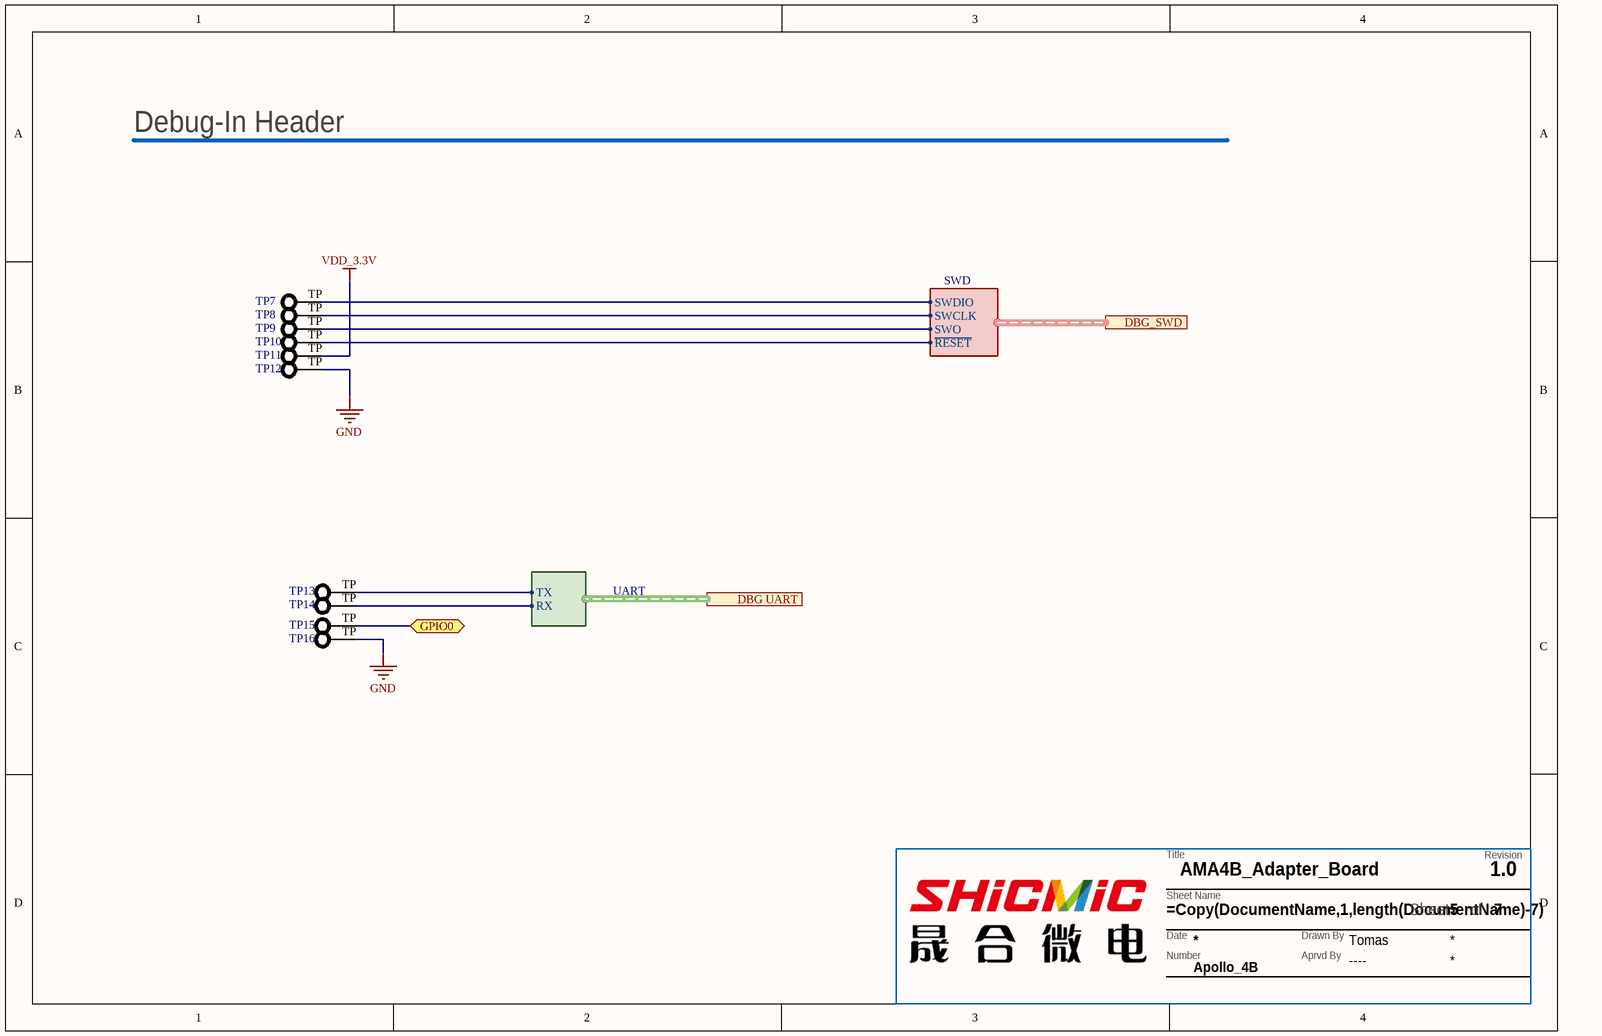
[diagram p4: P05_ Debugger.SchDoc]

### Parts
(Parts that share a designator on the sheet are numbered #1, #2 ... from top to bottom, then left to right.)
??#1  TitleBlock  (value not drawn)  (graphical)
TP7  PAD  [TPPAD_1.0mm]  (value not drawn)  (no BOM)
TP8  PAD  [TPPAD_1.0mm]  (value not drawn)  (no BOM)
TP9  PAD  [TPPAD_1.0mm]  (value not drawn)  (no BOM)
TP10  PAD  [TPPAD_1.0mm]  (value not drawn)  (no BOM)
TP11  PAD  [TPPAD_1.0mm]  (value not drawn)  (no BOM)
TP12  PAD  [TPPAD_1.0mm]  (value not drawn)  (no BOM)
TP13  PAD  [TPPAD_1.0mm]  (value not drawn)  (no BOM)
TP14  PAD  [TPPAD_1.0mm]  (value not drawn)  (no BOM)
TP15  PAD  [TPPAD_1.0mm]  (value not drawn)  (no BOM)
TP16  PAD  [TPPAD_1.0mm]  (value not drawn)  (no BOM)

### Ports
DBG UART (harness UART), DBG_SWD (harness SWD), GPIO0 (bidir)

### Harnesses
SWD: SWCLK, SWDIO, SWO, ~{RESET}
UART: TX, RX

### Nets
GND: TP12.TP TP16.TP
VDD_3.3V: TP11.TP
GPIO0: TP15.TP ; port GPIO0
GPIO39: TP7.TP ; port DBG_SWD.SWDIO
GPIO40: TP8.TP ; port DBG_SWD.SWCLK
GPIO41: TP9.TP ; port DBG_SWD.SWO
GPIO42: TP10.TP ; port DBG_SWD.~{RESET}
U0RXD: TP14.TP ; port DBG UART.RX
NetR2_2: TP13.TP ; port DBG UART.TX

### Notes on the sheet
- Debug-In Header
- (in symbol TitleBlock) Revision; Title; Sheet Name; Sheet; of; Date; Drawn By; Number; Aprvd By

### Library data of the parts
??#1 = TitleBlock: as ?#1 on sheet P01_Top Level; AMBIQ PN: TitleBlock
TP7-TP16 = TP_PAD: None; AMBIQ PN: TP_PAD

## Sheet P02_AMOLED.SchDoc
size A4; SheetNumber: 2; SheetTotal: 7
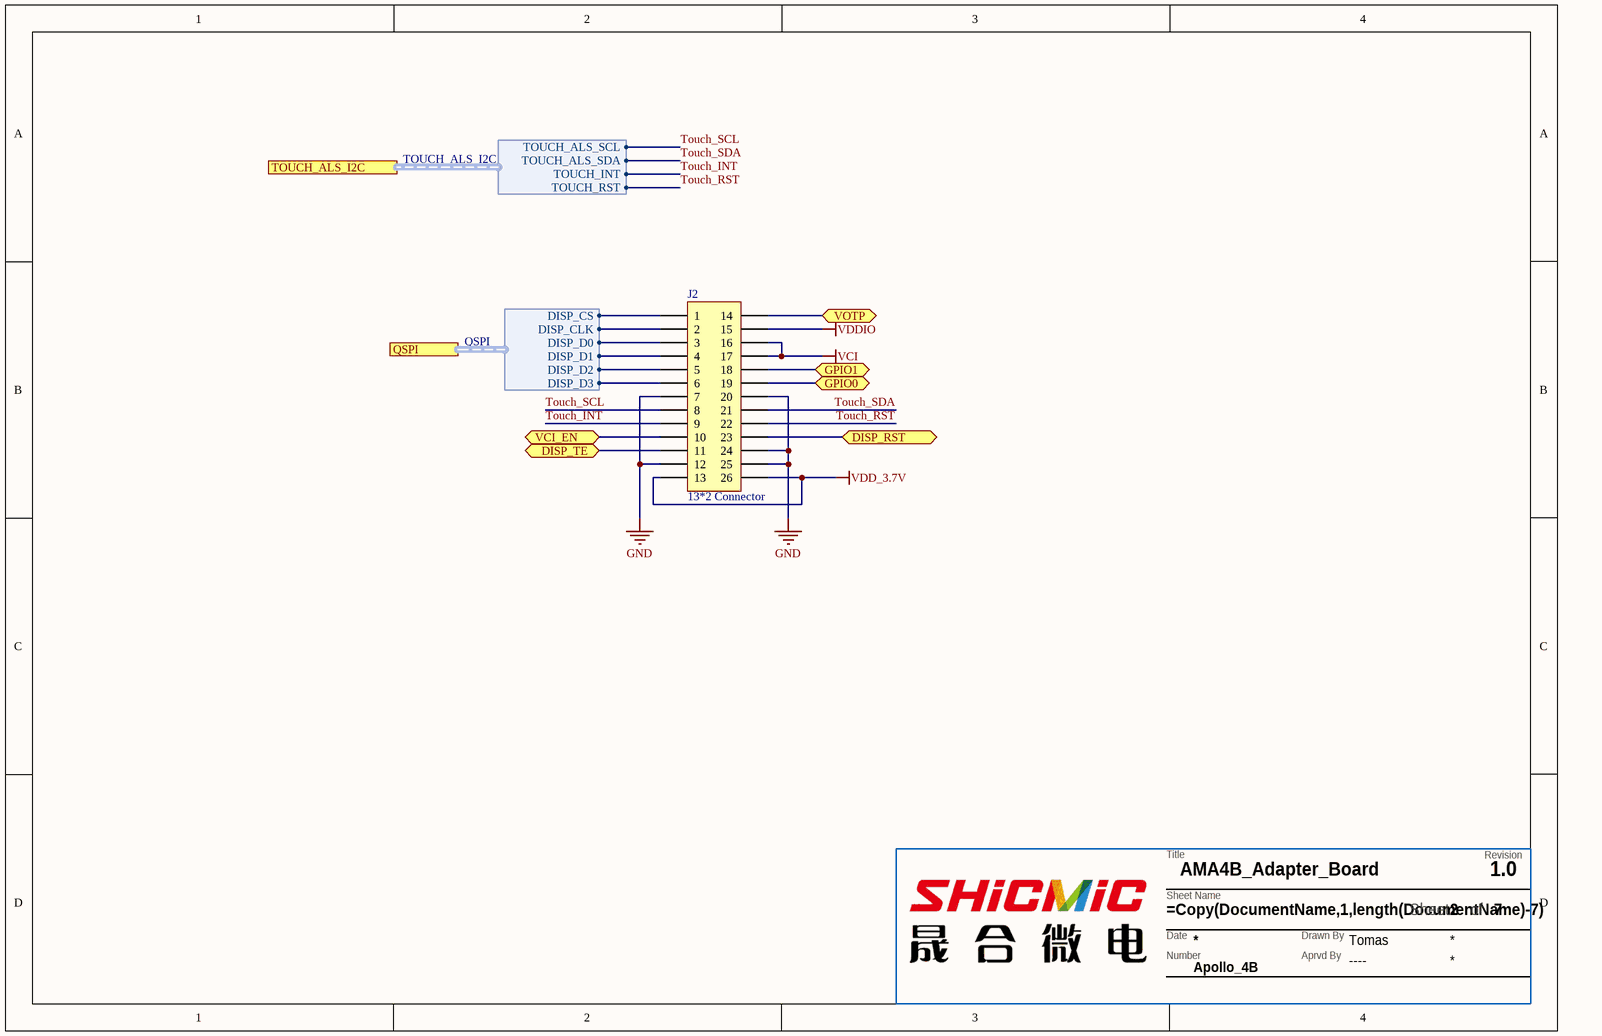
[diagram p5: P02_AMOLED.SchDoc]

### Parts
(Parts that share a designator on the sheet are numbered #1, #2 ... from top to bottom, then left to right.)
??#2  TitleBlock  (value not drawn)  (graphical)
J2  13*2 Connector  [13*2 Header]

### Ports
DISP_RST (bidir), DISP_TE (bidir), GPIO0 (bidir), GPIO1 (bidir), QSPI (harness QSPI), TOUCH_ALS_I2C (harness TOUCH_ALS_I2C), VCI_EN (bidir), VOTP (bidir)

### Harnesses
QSPI: DISP_CLK, DISP_CS, DISP_D0, DISP_D1, DISP_D2, DISP_D3
TOUCH_ALS_I2C: TOUCH_ALS_SCL, TOUCH_ALS_SDA, TOUCH_INT, TOUCH_RST

### Nets
GND: J2.7 J2.12 J2.20 J2.24 J2.25
VCI: J2.16 J2.17
VDD_3.7V: J2.13 J2.26
VDDIO: J2.15
GPIO1: J2.11 ; port DISP_TE
GPIO2: J2.23 ; port DISP_RST
GPIO4: J2.1 ; port QSPI.DISP_CS
GPIO5: J2.2 ; port QSPI.DISP_CLK
GPIO6: J2.3 ; port QSPI.DISP_D0
GPIO7: J2.4 ; port QSPI.DISP_D1
GPIO15: J2.5 ; port QSPI.DISP_D2
GPIO16: J2.6 ; port QSPI.DISP_D3
GPIO45: J2.19 ; port GPIO0
GPIO46: J2.18 ; port GPIO1
GPIO48: J2.10 ; port VCI_EN
Touch_INT: J2.9 ; port TOUCH_ALS_I2C.TOUCH_INT  [project net GPIO8]
Touch_RST: J2.22 ; port TOUCH_ALS_I2C.TOUCH_RST  [project net GPIO47]
Touch_SCL: J2.8 ; port TOUCH_ALS_I2C.TOUCH_ALS_SCL  [project net GPIO17]
Touch_SDA: J2.21 ; port TOUCH_ALS_I2C.TOUCH_ALS_SDA  [project net GPIO18]
NetJ2_14: J2.14 ; port VOTP

### Notes on the sheet
- (in symbol TitleBlock) Revision; Title; Sheet Name; Sheet; of; Date; Drawn By; Number; Aprvd By

### Library data of the parts
??#2 = TitleBlock: as ?#1 on sheet P01_Top Level; AMBIQ PN: TitleBlock

## Sheet P07_Peripheral.SchDoc
size A4; SheetNumber: 7; SheetTotal: 7
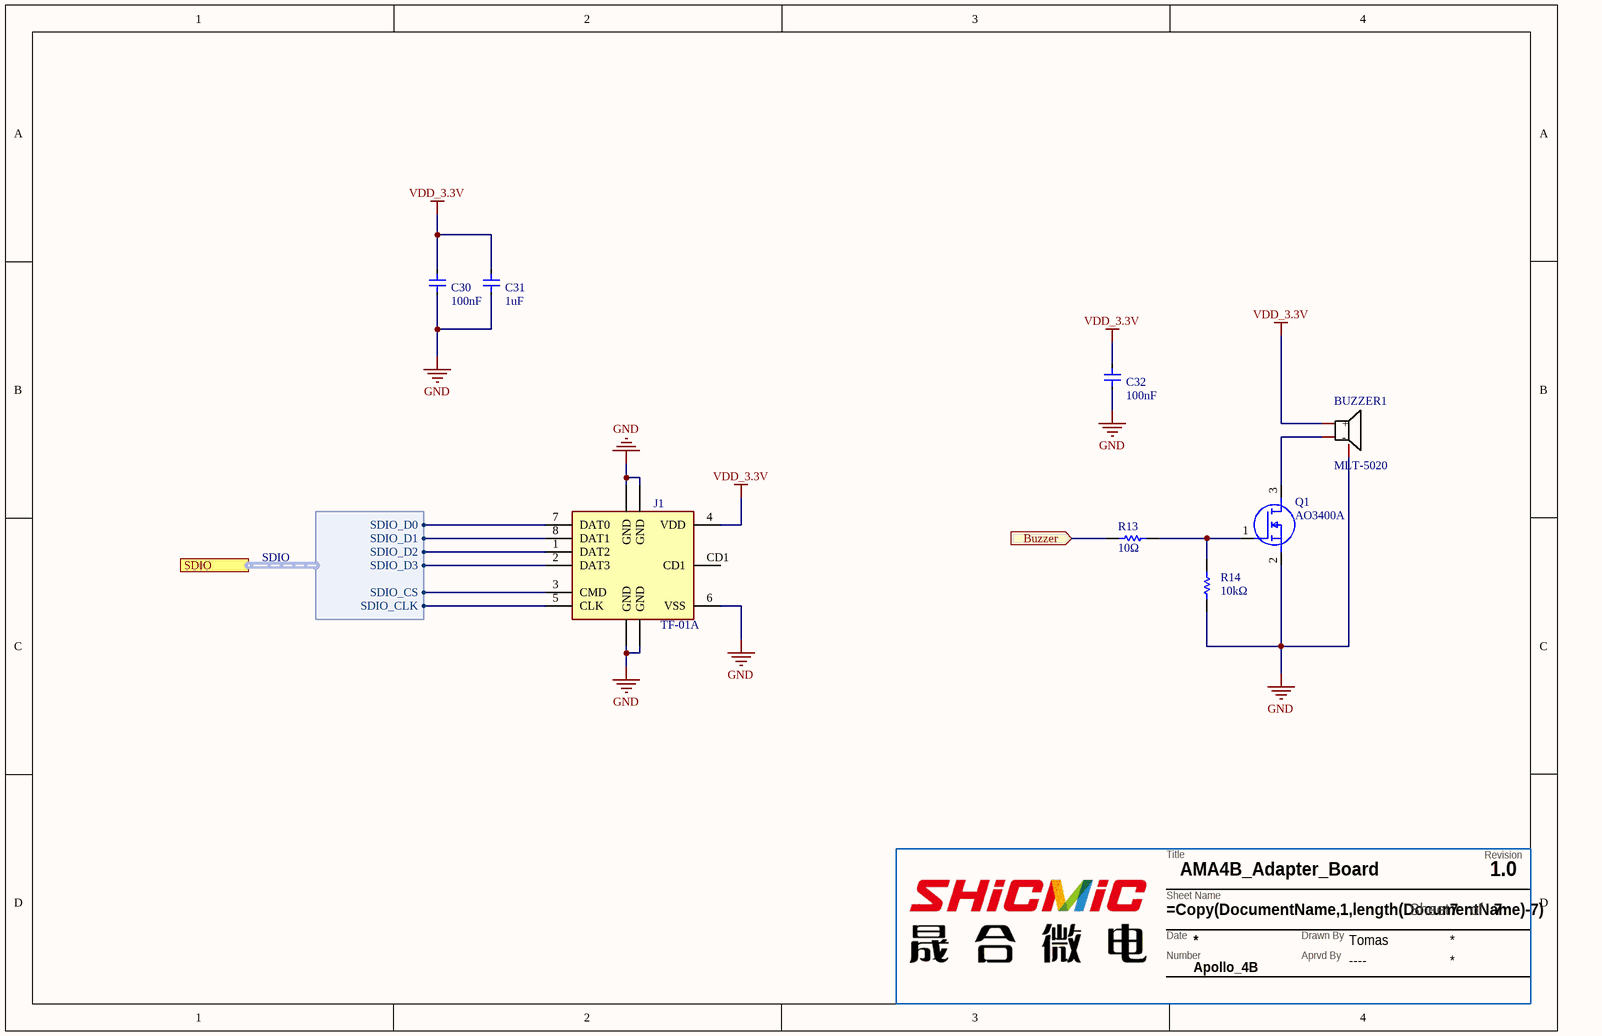
[diagram p6: P07_Peripheral.SchDoc]

### Parts
(Parts that share a designator on the sheet are numbered #1, #2 ... from top to bottom, then left to right.)
??#3  TitleBlock  (value not drawn)  (graphical)
BUZZER1  4000Hz  [BUZ-SMD_L5.0-W5.5-P4.60]  (value not drawn)
C30  100nF  [CAP_0402]
C31  1uF  [CAP_0402]
C32  100nF  [CAP_0402]
J1  TF-01A  [TF01A]
Q1  AO3400A  [SOT95P280X125-3N]
R13  10Ω  [RES_0402]
R14  10kΩ  [RES_0402]

### Ports
Buzzer (in), SDIO (harness SDIO)

### Harnesses
SDIO: SDIO_CLK, SDIO_CS, SDIO_D0, SDIO_D1, SDIO_D2, SDIO_D3

### Nets
GND: BUZZER1.3(NC) C30.2 C31.2 C32.2 J1.6(VSS) J1.MP1(GND) J1.MP2(GND) J1.MP3(GND) J1.MP4(GND) Q1.2(S) R14.1
VDD_3.3V: BUZZER1.1(+) C30.1 C31.1 C32.1 J1.4(VDD)
GPIO9: J1.1(DAT2) ; port SDIO.SDIO_D2
GPIO10: J1.2(DAT3) ; port SDIO.SDIO_D3
GPIO11: J1.3(CMD) ; port SDIO.SDIO_CS
GPIO12: J1.5(CLK) ; port SDIO.SDIO_CLK
GPIO13: J1.7(DAT0) ; port SDIO.SDIO_D0
GPIO14: J1.8(DAT1) ; port SDIO.SDIO_D1
GPIO38: R13.2 ; port Buzzer
NetBUZZER1_2: BUZZER1.2(-) Q1.3(D)
NetQ1_1: Q1.1(G) R13.1 R14.2

Not connected (* = marked no-connect by the designer): J1 CD1

### Notes on the sheet
- (in symbol TitleBlock) Revision; Title; Sheet Name; Sheet; of; Date; Drawn By; Number; Aprvd By

### Library data of the parts
??#3 = TitleBlock: as ?#1 on sheet P01_Top Level; AMBIQ PN: TitleBlock
BUZZER1 = MLT-5020: Manufacturer: 华能; Add into BOM: yes; Oscillator Circuit: 无源(外部驱动); Technology Type: 电磁式; Name: 4000Hz; Symbol: MLT-5020; LCSC Part Name: MLT-5020; Supplier Part: C94598; Manufacturer Part: MLT-5020; Supplier Footprint: SMD,5x5mm; JLCPCB Part Class: 扩展库; Datasheet: https://atta.szlcsc.com/upload/public/pdf/source/20210811/111454390007D221D7259018FB170E62.pdf; Supplier: LCSC; Convert to PCB: yes; Value: 4000Hz; Length: 5.2mm; Width: 5.2mm; Height: 2.5mm; Device: MLT-5020
C30 C32 = Capacitor: as C29 on sheet P03_ Power Supplies; Supplier 1: Arrow Electronics; Supplier Part Number 1: 0201ZD104KAT2A; Manufacturer Part Number: 0201ZD104KAT2A; RoHS: Yes; Category: Ceramic Capacitors; Stock 1: 105000; Pricing 1: 15000=0.00770, 30000=0.00750, 45000=0.00740, 60000=0.00720, 75000=0.00690, 150000=0.00620 (USD); Mount: Surface Mount; Case/Package: 0201; Case Code (Metric): 0603; Case Code (Imperial): 0201; Min Operating Temperature: -55°C; Max Operating Temperature: 85°C; Capacitance: 100nF; Packaging: Tape and Reel; Voltage Rating (DC): 10V; Series: -; Lead Free: Lead Free; RoHS Compliant: Yes; ComponentLink1URL: http://www.mouser.com/ds/2/40/cx5r-776519.pdf?src-supplier=Mouser; ComponentLink1Description: http://www.mouser.com/ds/2/40/cx5r-776519.pdf?src-supplier=Mouser
C31 = Capacitor: as C2 on sheet P06_ESP32S3R8_Core; Supplier 1: Newark; Supplier Part Number 1: 82AC9184; RoHS: Yes; Category: Ceramic Capacitors; Mount: Surface Mount; Case/Package: 0402; Case Code (Metric): 1005; Case Code (Imperial): 0402; Min Operating Temperature: -55°C; Max Operating Temperature: 85°C; Capacitance: 1uF; Packaging: Tape and Reel; Voltage Rating (DC): 10V; Series: CL; Construction: Flat; Length: 1mm; Width: 0.02inch; Height: 0.5mm; Thickness: 0.022inch; Depth: 0.5mm; Radiation Hardening: No; Lead Free: Lead Free; RoHS Compliant: Yes; ComponentLink1URL: https://datasheet.ciiva.com/25802/cl05a105mp5nnnc-25802049.pdf?src-supplier=Digi-Key; ComponentLink1Description: https://datasheet.ciiva.com/25802/cl05a105mp5nnnc-25802049.pdf?src-supplier=Digi-Key; Package Quantity: 1
J1 = TF-01A: Connector; Manufacturer_Name: Korean Hroparts Elec; Datasheet Link: https://datasheet.lcsc.com/szlcsc/1903221101_Korean-Hroparts-Elec-TF-01A_C91145.pdf; Height: 1.85mm; Manufacturer_Part_Number: TF-01A
Q1 = AO3400A: MOSFET (N-Channel); Manufacturer_Name: Alpha & Omega Semiconductors; Datasheet Link: http://aosmd.com/res/data_sheets/AO3400A.pdf; Height: 1.25mm; Manufacturer_Part_Number: AO3400A; Arrow Part Number: AO3400A; Arrow Price/Stock: https://www.arrow.com/en/products/ao3400a/alpha-and-omega-semiconductor?region=nac
R13 R14 = Resistor: as R8 on sheet P03_ Power Supplies; Supplier 1: Arrow Electronics; Supplier Part Number 1: RC0402FR-0710KL; Manufacturer Part Number: RC0402FR-0710KL; RoHS: Yes; Category: Chip SMD Resistors; Stock 1: 7776428; Pricing 1: 10000=0.00210 (USD); Case/Package: 0402; Case Code (Metric): 1005; Case Code (Imperial): 0402; Min Operating Temperature: -55°C; Max Operating Temperature: 155°C; Packaging: Tape and Reel; Resistor Type: Thick Film; Number of Terminations: 2; Termination: SMD/SMT; Voltage Rating (DC): 50V; Features: Moisture Resistant; Series: RC; Construction: Rectangular; Length: 1mm; Width: 0.5mm; Height: 0.32mm; Depth: 0.5mm; REACH SVHC: No SVHC; Military Standard: Not; Lead Free: Lead Free; RoHS Compliant: Yes; ComponentLink1URL: https://datasheet.ciiva.com/7660/38568-7660787.pdf?src-supplier=Element14; ComponentLink1Description: https://datasheet.ciiva.com/7660/38568-7660787.pdf?src-supplier=Element14; ComponentLink2URL: https://datasheet.ciiva.com/7849/1686128-7849814.pdf?src-supplier=Element14; ComponentLink2Description: https://datasheet.ciiva.com/7849/1686128-7849814.pdf?src-supplier=Element14; ComponentLink3URL: https://datasheet.ciiva.com/7983/1018594-7983486.pdf?src-supplier=Element14; Tolerance: 1%; Number of Pins: 2; Resistance Tolerance: 1%; Working Voltage: 50V; Lead Pitch: 0.2mm

## Nets that join several sheets
GND: P01_Top Level (S2.1 S3.1 S4.1 S5.1), P06_ESP32S3R8_Core (14 pins), P03_ Power Supplies (34 pins), P04_ USB (11 pins), P05_ Debugger (TP12.TP TP16.TP), P02_AMOLED (5 pins), P07_Peripheral (11 pins)
VBUS_5V: P03_ Power Supplies (C22.2 IC3.31), P04_ USB (FB1.2 IC6.5)
VCI: P03_ Power Supplies (C40.2 IC3.11), P02_AMOLED (J2.16 J2.17)
VDD_3.3V: P06_ESP32S3R8_Core (6 pins), P03_ Power Supplies (C23.2 C24.2 IC3.17 L3.2), P05_ Debugger (TP11.TP), P07_Peripheral (5 pins)
VDDIO: P03_ Power Supplies (C28.2 IC3.12), P02_AMOLED (J2.15)
AP_USB_N: P06_ESP32S3R8_Core (U1.13), P04_ USB (IC6.3)
AP_USB_P: P06_ESP32S3R8_Core (U1.14), P04_ USB (IC6.1)
CHIP_PU: P06_ESP32S3R8_Core (C15.1 R6.1 U1.3), P03_ Power Supplies (IC3.25)
GPIO0: P06_ESP32S3R8_Core (U1.27), P05_ Debugger (TP15.TP)
GPIO1: P06_ESP32S3R8_Core (U1.39), P02_AMOLED (J2.11)
GPIO2: P06_ESP32S3R8_Core (U1.38), P02_AMOLED (J2.23)
GPIO3: P06_ESP32S3R8_Core (U1.15), P03_ Power Supplies (R10.1 S1.2)
GPIO4: P06_ESP32S3R8_Core (U1.4), P02_AMOLED (J2.1)
GPIO5: P06_ESP32S3R8_Core (U1.5), P02_AMOLED (J2.2)
GPIO6: P06_ESP32S3R8_Core (U1.6), P02_AMOLED (J2.3)
GPIO7: P06_ESP32S3R8_Core (U1.7), P02_AMOLED (J2.4)
GPIO8: P06_ESP32S3R8_Core (U1.12), P02_AMOLED (J2.9)
GPIO9: P06_ESP32S3R8_Core (U1.17), P07_Peripheral (J1.1)
GPIO10: P06_ESP32S3R8_Core (U1.18), P07_Peripheral (J1.2)
GPIO11: P06_ESP32S3R8_Core (U1.19), P07_Peripheral (J1.3)
GPIO12: P06_ESP32S3R8_Core (U1.20), P07_Peripheral (J1.5)
GPIO13: P06_ESP32S3R8_Core (U1.21), P07_Peripheral (J1.7)
GPIO14: P06_ESP32S3R8_Core (U1.22), P07_Peripheral (J1.8)
GPIO15: P06_ESP32S3R8_Core (U1.8), P02_AMOLED (J2.5)
GPIO16: P06_ESP32S3R8_Core (U1.9), P02_AMOLED (J2.6)
GPIO17: P06_ESP32S3R8_Core (R4.2 U1.10), P03_ Power Supplies (IC3.2), P02_AMOLED (J2.8)
GPIO18: P06_ESP32S3R8_Core (R5.2 U1.11), P03_ Power Supplies (IC3.1), P02_AMOLED (J2.21)
GPIO21: P06_ESP32S3R8_Core (U1.23), P03_ Power Supplies (IC3.48)
GPIO38: P06_ESP32S3R8_Core (U1.31), P07_Peripheral (R13.2)
GPIO39: P06_ESP32S3R8_Core (U1.32), P05_ Debugger (TP7.TP)
GPIO40: P06_ESP32S3R8_Core (U1.33), P05_ Debugger (TP8.TP)
GPIO41: P06_ESP32S3R8_Core (U1.34), P05_ Debugger (TP9.TP)
GPIO42: P06_ESP32S3R8_Core (U1.35), P05_ Debugger (TP10.TP)
GPIO45: P06_ESP32S3R8_Core (U1.26), P02_AMOLED (J2.19)
GPIO46: P06_ESP32S3R8_Core (U1.16), P02_AMOLED (J2.18)
GPIO47: P06_ESP32S3R8_Core (U1.24), P02_AMOLED (J2.22)
GPIO48: P06_ESP32S3R8_Core (U1.25), P02_AMOLED (J2.10)
NetR2_2: P06_ESP32S3R8_Core (R2.2), P05_ Debugger (TP13.TP)
U0RXD: P06_ESP32S3R8_Core (U1.36), P05_ Debugger (TP14.TP)

## Assembly variants
AMAP4BPXEVB: all parts fitted